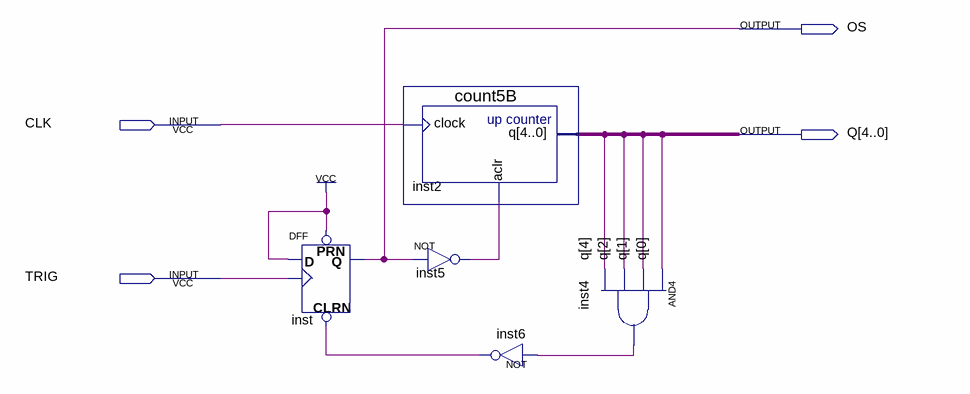
[diagram p0: schematic sheet]
// Quartus schematic oneshot22.bdf as structural Verilog: 5 symbols, 4 pins
module oneshot22 (
  input  CLK,
  input  TRIG,
  output OS,
  output [4:0] Q
);

  wire inst4_out, inst5_out, inst6_out;

  DFF inst (.CLRN(inst6_out), .CLK(TRIG), .D(1'b1), .PRN(1'b1), .Q(OS));
  count5B inst2 (.clock(CLK), .aclr(inst5_out), .q(Q));
  not inst5 (inst5_out, OS);
  not inst6 (inst6_out, inst4_out);
  and inst4 (inst4_out, Q[0], Q[1], Q[2], Q[4]);
endmodule
